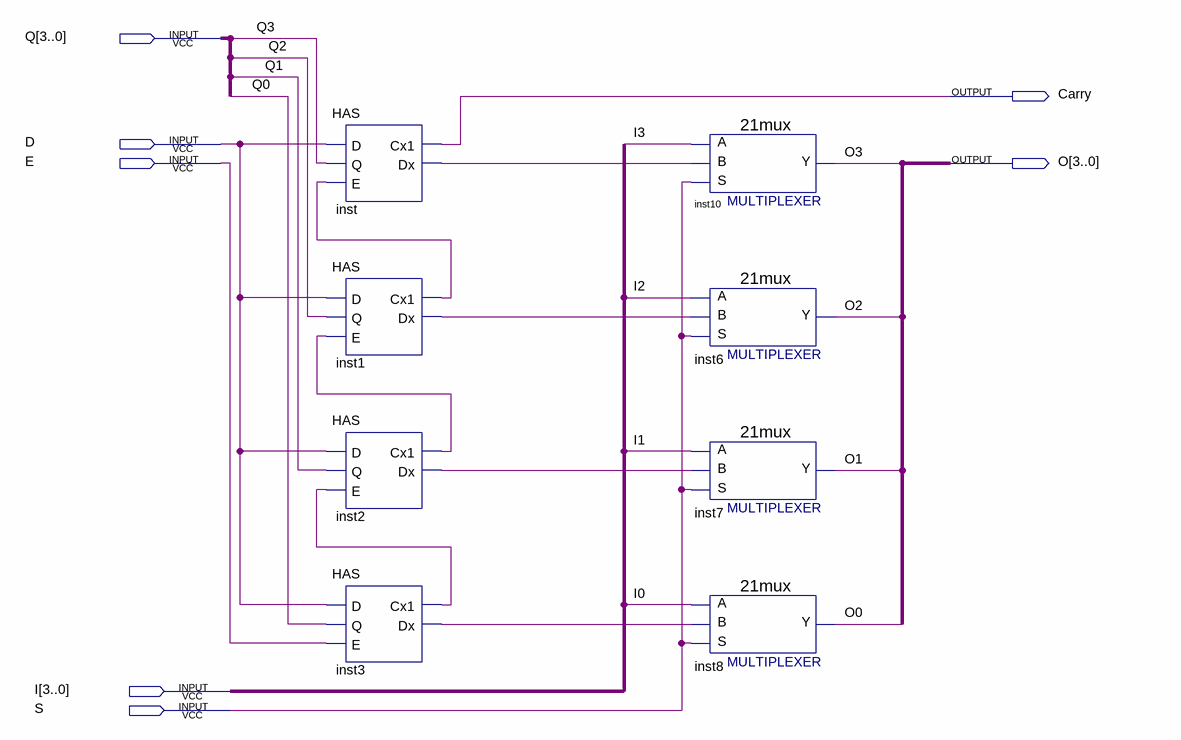
[diagram p0: schematic sheet]
// Quartus schematic Comb1.bdf as structural Verilog: 8 symbols, 7 pins
module Comb1 (
  input  [3:0] Q,
  input  D,
  input  E,
  input  [3:0] I,
  input  S,
  output Carry,
  output [3:0] O
);

  wire inst1_cx1, inst1_dx, inst2_cx1, inst2_dx, inst3_cx1, inst3_dx, inst_dx;

  HAS inst (.D(D), .Q(Q[3]), .E(inst1_cx1), .Cx1(Carry), .Dx(inst_dx));
  HAS inst1 (.D(D), .Q(Q[2]), .E(inst2_cx1), .Cx1(inst1_cx1), .Dx(inst1_dx));
  HAS inst2 (.D(D), .Q(Q[1]), .E(inst3_cx1), .Cx1(inst2_cx1), .Dx(inst2_dx));
  HAS inst3 (.D(D), .Q(Q[0]), .E(E), .Cx1(inst3_cx1), .Dx(inst3_dx));
  \21mux  inst10 (.S(S), .B(inst_dx), .A(I[3]), .Y(O[3]));
  \21mux  inst6 (.S(S), .B(inst1_dx), .A(I[2]), .Y(O[2]));
  \21mux  inst7 (.S(S), .B(inst2_dx), .A(I[1]), .Y(O[1]));
  \21mux  inst8 (.S(S), .B(inst3_dx), .A(I[0]), .Y(O[0]));
endmodule
